# EAGLE schematic Main_Board (EAGLE 7.7.0)

## Sheet 1 of 5: Ethernet&CAN
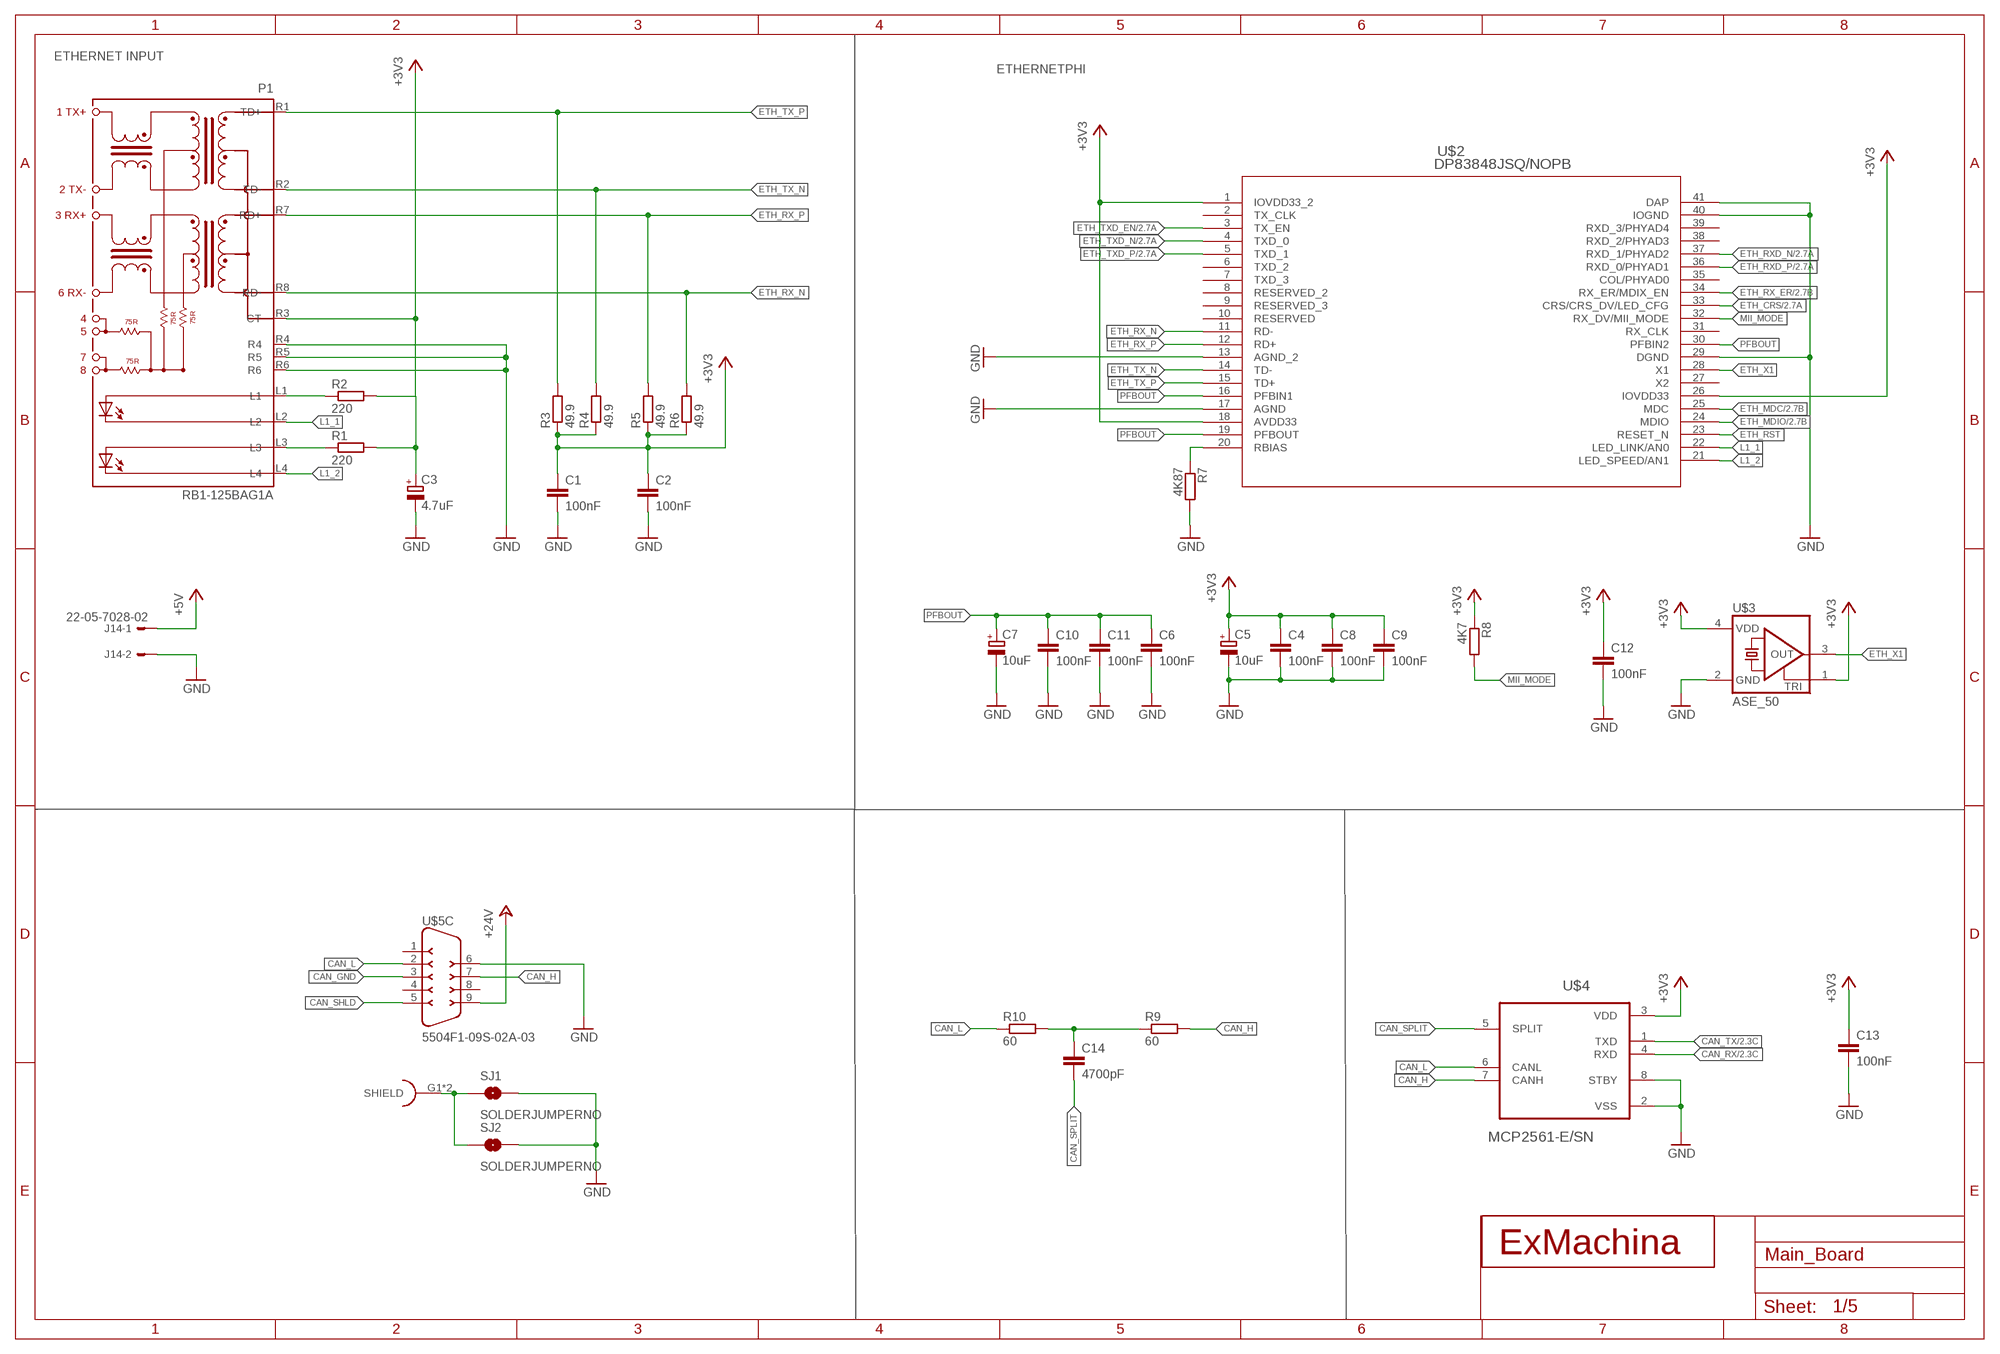
[diagram p0: schematic, sheet 1]

### Parts
C1  100nF  C-EUC0603  [C0603]
C2  100nF  C-EUC0603  [C0603]
C3  4.7uF  CPOL-EUCT3216  [CT3216]
C4  100nF  C-EUC0603  [C0603]
C5  10uF  CPOL-EUCT3216  [CT3216]
C6  100nF  C-EUC0603  [C0603]
C7  10uF  CPOL-EUCT3216  [CT3216]
C8  100nF  C-EUC0603  [C0603]
C9  100nF  C-EUC0603  [C0603]
C10  100nF  C-EUC0603  [C0603]
C11  100nF  C-EUC0603  [C0603]
C12  100nF  C-EUC0603  [C0603]
C13  100nF  C-EUC0603  [C0603]
C14  4700pF  C-EUC0603  [C0603]
J14  22-05-7028-02  [7395-02]
P1  RB1-125BAG1A  [WIZNET_RB1-125BAG1A]
R1  220  R-EU_R0603  [R0603]
R2  220  R-EU_R0603  [R0603]
R3  49.9  R-EU_R0603  [R0603]
R4  49.9  R-EU_R0603  [R0603]
R5  49.9  R-EU_R0603  [R0603]
R6  49.9  R-EU_R0603  [R0603]
R7  4K87  R-EU_R0603  [R0603]
R8  4K7  R-EU_R0603  [R0603]
R9  60  R-EU_R0603  [R0603]
R10  60  R-EU_R0603  [R0603]
SJ1  SOLDERJUMPERNO  [SJ_2S-NO]
SJ2  SOLDERJUMPERNO  [SJ_2S-NO]
U$1  EXMACHINA-LOGO-NAME  [EXM-LOGO-BASELINE]
U$2  DP83848JSQ/NOPB  [SQA40B]
U$3  ASE_50  ASE  [ASE]
U$4  MCP2561-E/SN  [SOIC127P600X175-8N]
U$5  5504F1-09S-02A-03  [5504F1-09S-02A]

### Nets
+3V3 [supply]: C1.1 C2.1 C3.+ C4.1 C5.+ C8.1 C9.1 C12.1 C13.1 P1.R3(CT) R1.2 R2.2 R3.1 R4.1 R5.1 R6.1 R8.1 U$2.1(IOVDD33_2) U$2.18(AVDD33) U$2.26(IOVDD33) U$3.1(TRI) U$3.4(VDD) U$4.3(VDD) ; also sheet 2,3,4,5
+5V [supply]: J14.1 ; also sheet 3,4,5
+24V: U$5.9 ; also sheet 3,5
CAN_GND: U$5.3
CAN_H [signal]: R9.2 U$4.7(CANH) U$5.7
CAN_L [signal]: R10.1 U$4.6(CANL) U$5.2
CAN_RX [signal]: U$4.4(RXD) ; also sheet 2
CAN_SHLD: U$5.5
CAN_SPLIT [signal]: C14.2 U$4.5(SPLIT)
CAN_TX [signal]: U$4.1(TXD) ; also sheet 2
ETH_CRS [signal]: U$2.33(CRS/CRS_DV/LED_CFG) ; also sheet 2
ETH_MDC [signal]: U$2.25(MDC) ; also sheet 2
ETH_MDIO [signal]: U$2.24(MDIO) ; also sheet 2
ETH_RST [signal]: U$2.23(RESET_N)
ETH_RX_ER [signal]: U$2.34(RX_ER/MDIX_EN) ; also sheet 2
ETH_RX_N [signal]: P1.R8(RD-) R6.2 U$2.11(RD-)
ETH_RX_P [signal]: P1.R7(RD+) R5.2 U$2.12(RD+)
ETH_RXD_N [signal]: U$2.37(RXD_1/PHYAD2) ; also sheet 2
ETH_RXD_P [signal]: U$2.36(RXD_0/PHYAD1) ; also sheet 2
ETH_TX_N [signal]: P1.R2(TD-) R4.2 U$2.14(TD-)
ETH_TX_P [signal]: P1.R1(TD+) R3.2 U$2.15(TD+)
ETH_TXD_EN [signal]: U$2.3(TX_EN) ; also sheet 2
ETH_TXD_N [signal]: U$2.4(TXD_0) ; also sheet 2
ETH_TXD_P [signal]: U$2.5(TXD_1) ; also sheet 2
ETH_X1 [signal]: U$2.28(X1) U$3.3(OUT)
GND [supply]: C1.2 C2.2 C3.- C4.2 C5.- C6.2 C7.- C8.2 C9.2 C10.2 C11.2 C12.2 C13.2 J14.2 P1.R4 P1.R5 P1.R6 R7.2 SJ1.2 SJ2.2 U$2.13(AGND_2) U$2.17(AGND) U$2.29(DGND) U$2.40(IOGND) U$2.41(DAP) U$3.2(GND) U$4.2(VSS) U$4.8(STBY) U$5.6 ; also sheet 2,3,4,5
L1_1 [signal]: P1.L2 U$2.22(LED_LINK/AN0)
L1_2 [signal]: P1.L4 U$2.21(LED_SPEED/AN1)
MII_MODE [signal]: R8.2 U$2.32(RX_DV/MII_MODE)
N$3: C14.1 R9.1 R10.2
N$4: R7.1 U$2.20(RBIAS)
N$6: SJ1.1 SJ2.1 U$5.G1(S:SHIELD) U$5.G2(S:SHIELD)
N$8 [signal]: P1.L1 R2.1
N$9 [signal]: P1.L3 R1.1
PFBOUT [signal]: C6.1 C7.+ C10.1 C11.1 U$2.16(PFBIN1) U$2.19(PFBOUT) U$2.30(PFBIN2)
Unconnected: U$2.2(TX_CLK) U$2.6(TXD_2) U$2.7(TXD_3) U$2.8(RESERVED_2) U$2.9(RESERVED_3) U$2.10(RESERVED) U$2.27(X2) U$2.31(RX_CLK) U$2.35(COL/PHYAD0) U$2.38(RXD_2/PHYAD3) U$2.39(RXD_3/PHYAD4) U$5.1 U$5.4 U$5.8

### Notes on the sheet
- ETHERNET INPUT
- ETHERNETPHI

## Sheet 2 of 5: LPC1768 + EEPROM
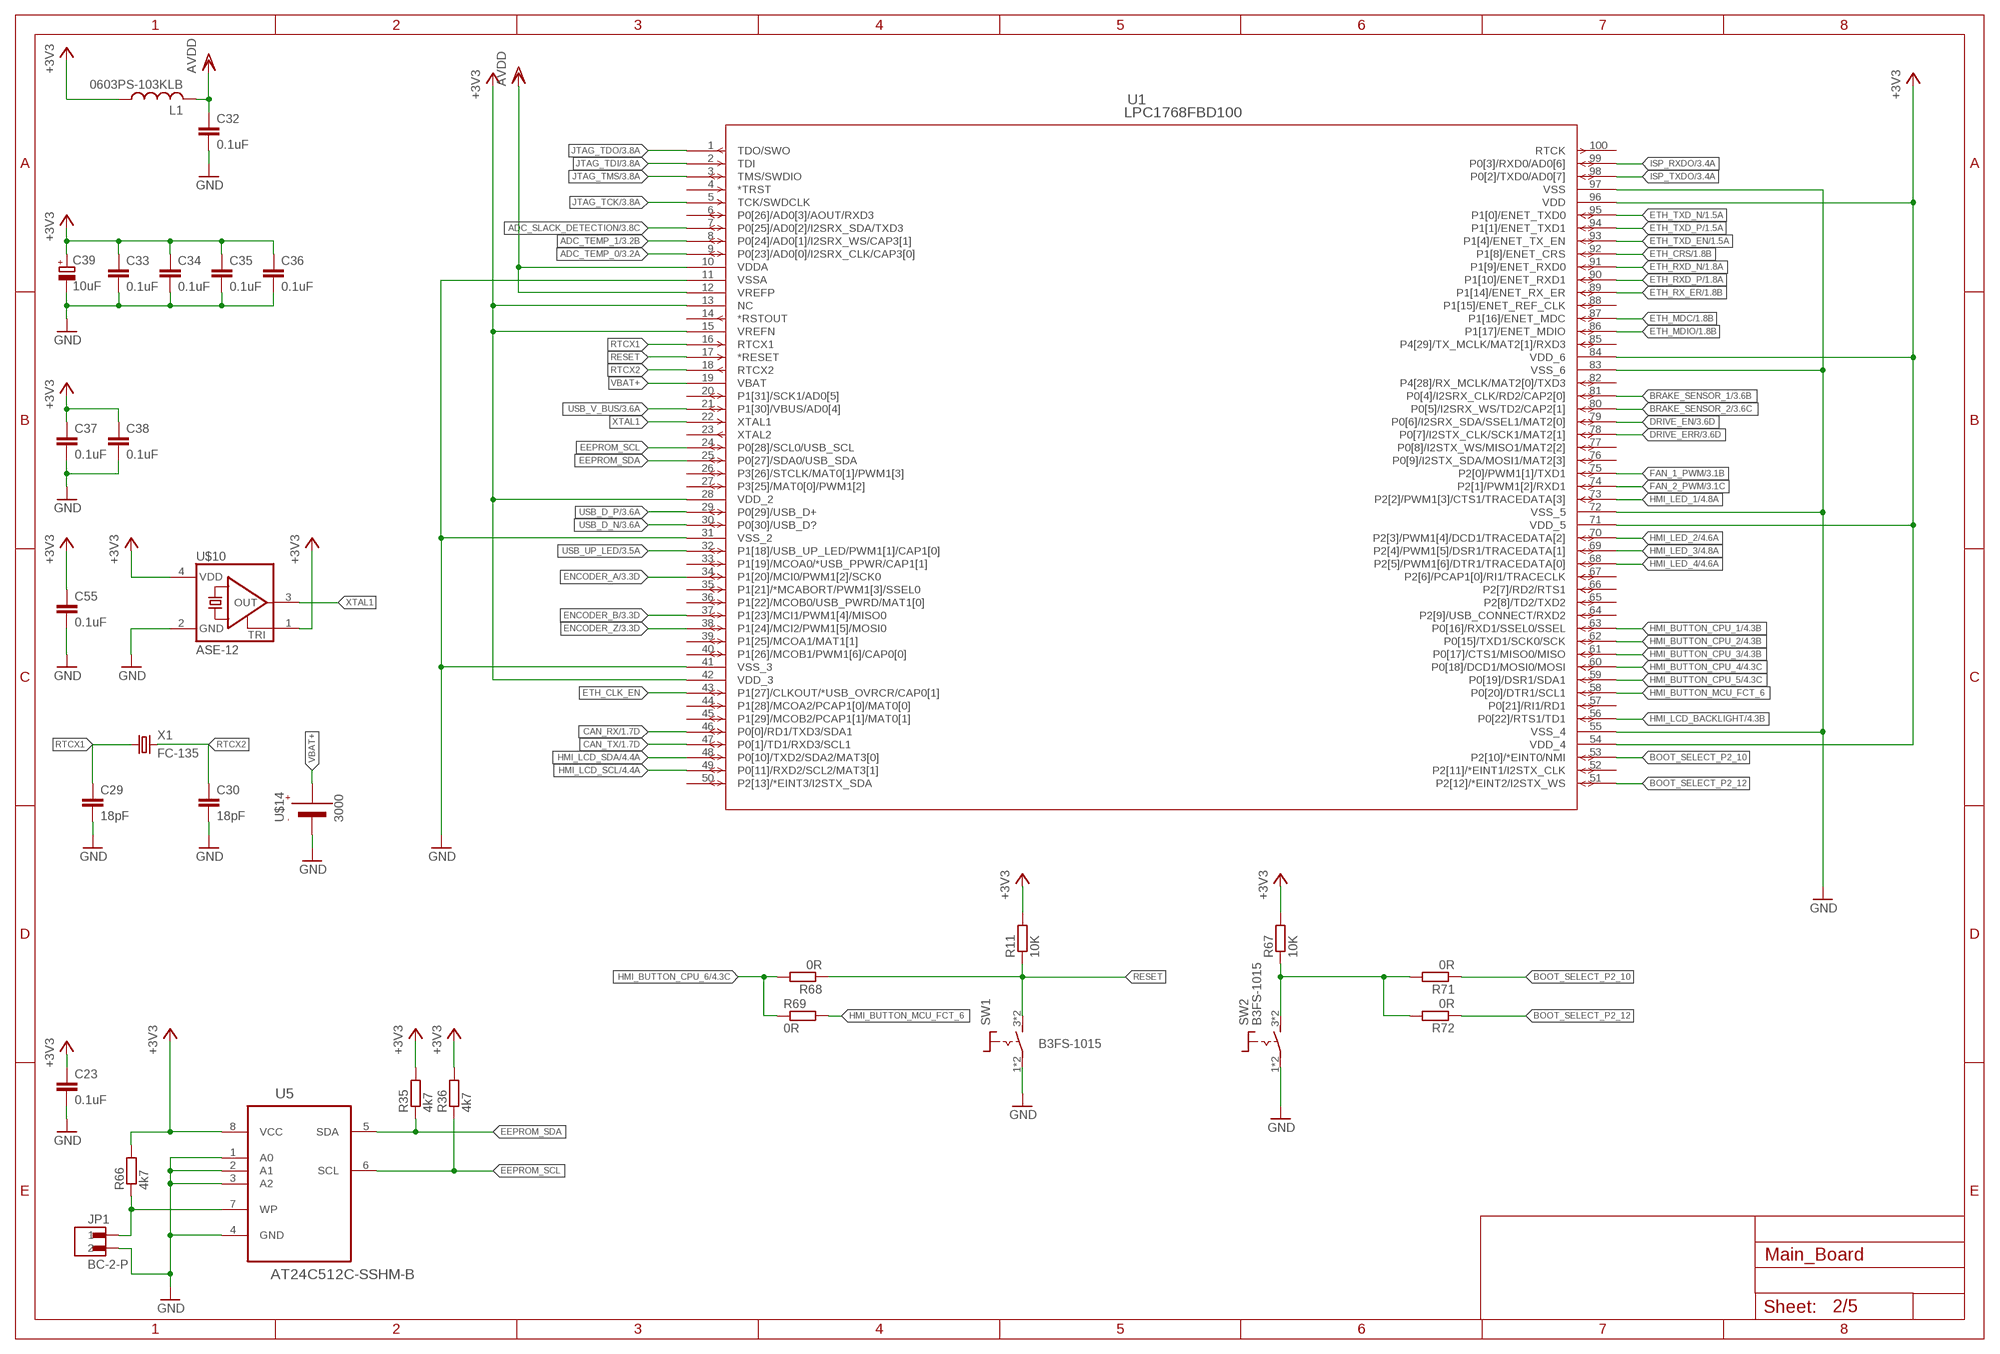
[diagram p1: schematic, sheet 2]

### Parts
C23  0.1uF  C-EUC0603  [C0603]
C29  18pF  C-EUC0603  [C0603]
C30  18pF  C-EUC0603  [C0603]
C32  0.1uF  C-EUC0603  [C0603]
C33  0.1uF  C-EUC0603  [C0603]
C34  0.1uF  C-EUC0603  [C0603]
C35  0.1uF  C-EUC0603  [C0603]
C36  0.1uF  C-EUC0603  [C0603]
C37  0.1uF  C-EUC0603  [C0603]
C38  0.1uF  C-EUC0603  [C0603]
C39  10uF  CPOL-EUCT3216  [CT3216]
C55  0.1uF  C-EUC0603  [C0603]
JP1  BC-2-P  [BC-2-P]
L1  0603PS-103KLB  0603PS  [0603]
R11  10K  R-EU_R0603  [R0603]
R35  4k7  R-EU_R0603  [R0603]
R36  4k7  R-EU_R0603  [R0603]
R66  4k7  R-EU_R0603  [R0603]
R67  10K  R-EU_R0603  [R0603]
R68  0R  R-EU_R0603  [R0603]
R69  0R  R-EU_R0603  [R0603]
R71  0R  R-EU_R0603  [R0603]
R72  0R  R-EU_R0603  [R0603]
SW1  B3FS-1015  [B3FS]
SW2  B3FS-1015  [B3FS]
U1  LPC1768FBD100  [SOT407-1]
U5  AT24C512C-SSHM-B  [SOIC127P600X175-8N]
U$10  ASE-12  ASE  [ASE]
U$14  3000  [3000]
X1  FC-135  [FC-135]

### Nets
+3V3 [supply]: C23.1 C33.1 C34.1 C35.1 C36.1 C37.1 C38.1 C39.+ C55.1 L1.P$1 R11.2 R35.2 R36.2 R66.2 R67.2 U1.13(NC) U1.15(VREFN) U1.28(VDD_2) U1.42(VDD_3) U1.54(VDD_4) U1.71(VDD_5) U1.84(VDD_6) U1.96(VDD) U5.8(VCC) U$10.1(TRI) U$10.4(VDD) ; also sheet 1,3,4,5
ADC_SLACK_DETECTION [signal]: U1.7(P0[25]/AD0[2]/I2SRX_SDA/TXD3) ; also sheet 3
ADC_TEMP_0 [signal]: U1.9(P0[23]/AD0[0]/I2SRX_CLK/CAP3[0]) ; also sheet 3
ADC_TEMP_1 [signal]: U1.8(P0[24]/AD0[1]/I2SRX_WS/CAP3[1]) ; also sheet 3
AVDD: C32.1 L1.P$2 U1.10(VDDA) U1.12(VREFP) ; also sheet 3
BOOT_SELECT_P2_10 [signal]: R71.1 U1.53(P2[10]/*EINT0/NMI)
BOOT_SELECT_P2_12 [signal]: R72.1 U1.51(P2[12]/*EINT2/I2STX_WS)
BRAKE_SENSOR_1: U1.81(P0[4]/I2SRX_CLK/RD2/CAP2[0]) ; also sheet 3
BRAKE_SENSOR_2: U1.80(P0[5]/I2SRX_WS/TD2/CAP2[1]) ; also sheet 3
CAN_RX [signal]: U1.46(P0[0]/RD1/TXD3/SDA1) ; also sheet 1
CAN_TX [signal]: U1.47(P0[1]/TD1/RXD3/SCL1) ; also sheet 1
DRIVE_EN: U1.79(P0[6]/I2SRX_SDA/SSEL1/MAT2[0]) ; also sheet 3
DRIVE_ERR: U1.78(P0[7]/I2STX_CLK/SCK1/MAT2[1]) ; also sheet 3
EEPROM_SCL: R36.1 U1.24(P0[28]/SCL0/USB_SCL) U5.6(SCL)
EEPROM_SDA: R35.1 U1.25(P0[27]/SDA0/USB_SDA) U5.5(SDA)
ENCODER_A: U1.34(P1[20]/MCI0/PWM1[2]/SCK0) ; also sheet 3
ENCODER_B: U1.37(P1[23]/MCI1/PWM1[4]/MISO0) ; also sheet 3
ENCODER_Z: U1.38(P1[24]/MCI2/PWM1[5]/MOSI0) ; also sheet 3
ETH_CLK_EN [signal]: U1.43(P1[27]/CLKOUT/*USB_OVRCR/CAP0[1])
ETH_CRS [signal]: U1.92(P1[8]/ENET_CRS) ; also sheet 1
ETH_MDC [signal]: U1.87(P1[16]/ENET_MDC) ; also sheet 1
ETH_MDIO [signal]: U1.86(P1[17]/ENET_MDIO) ; also sheet 1
ETH_RX_ER [signal]: U1.89(P1[14]/ENET_RX_ER) ; also sheet 1
ETH_RXD_N [signal]: U1.91(P1[9]/ENET_RXD0) ; also sheet 1
ETH_RXD_P [signal]: U1.90(P1[10]/ENET_RXD1) ; also sheet 1
ETH_TXD_EN [signal]: U1.93(P1[4]/ENET_TX_EN) ; also sheet 1
ETH_TXD_N [signal]: U1.95(P1[0]/ENET_TXD0) ; also sheet 1
ETH_TXD_P [signal]: U1.94(P1[1]/ENET_TXD1) ; also sheet 1
FAN_1_PWM [signal]: U1.75(P2[0]/PWM1[1]/TXD1) ; also sheet 3
FAN_2_PWM [signal]: U1.74(P2[1]/PWM1[2]/RXD1) ; also sheet 3
GND [supply]: C23.2 C29.2 C30.2 C32.2 C33.2 C34.2 C35.2 C36.2 C37.2 C38.2 C39.- C55.2 JP1.2 SW1.1 SW1.2 SW2.1 SW2.2 U1.11(VSSA) U1.31(VSS_2) U1.41(VSS_3) U1.55(VSS_4) U1.72(VSS_5) U1.83(VSS_6) U1.97(VSS) U5.1(A0) U5.2(A1) U5.3(A2) U5.4(GND) U$10.2(GND) U$14.-(VBAT-) ; also sheet 1,3,4,5
HMI_BUTTON_CPU_1: U1.63(P0[16]/RXD1/SSEL0/SSEL) ; also sheet 4
HMI_BUTTON_CPU_2: U1.62(P0[15]/TXD1/SCK0/SCK) ; also sheet 4
HMI_BUTTON_CPU_3: U1.61(P0[17]/CTS1/MISO0/MISO) ; also sheet 4
HMI_BUTTON_CPU_4: U1.60(P0[18]/DCD1/MOSI0/MOSI) ; also sheet 4
HMI_BUTTON_CPU_5: U1.59(P0[19]/DSR1/SDA1) ; also sheet 4
HMI_BUTTON_CPU_6: R68.2 R69.1 ; also sheet 4
HMI_BUTTON_MCU_FCT_6: R69.2 U1.58(P0[20]/DTR1/SCL1)
HMI_LCD_BACKLIGHT: U1.56(P0[22]/RTS1/TD1) ; also sheet 4
HMI_LCD_SCL [signal]: U1.49(P0[11]/RXD2/SCL2/MAT3[1]) ; also sheet 4
HMI_LCD_SDA [signal]: U1.48(P0[10]/TXD2/SDA2/MAT3[0]) ; also sheet 4
HMI_LED_1 [signal]: U1.73(P2[2]/PWM1[3]/CTS1/TRACEDATA[3]) ; also sheet 4
HMI_LED_2 [signal]: U1.70(P2[3]/PWM1[4]/DCD1/TRACEDATA[2]) ; also sheet 4
HMI_LED_3 [signal]: U1.69(P2[4]/PWM1[5]/DSR1/TRACEDATA[1]) ; also sheet 4
HMI_LED_4 [signal]: U1.68(P2[5]/PWM1[6]/DTR1/TRACEDATA[0]) ; also sheet 4
ISP_RXDO [signal]: U1.99(P0[3]/RXD0/AD0[6]) ; also sheet 3
ISP_TXDO [signal]: U1.98(P0[2]/TXD0/AD0[7]) ; also sheet 3
JTAG_TCK [signal]: U1.5(TCK/SWDCLK) ; also sheet 3
JTAG_TDI [signal]: U1.2(TDI) ; also sheet 3
JTAG_TDO [signal]: U1.1(TDO/SWO) ; also sheet 3
JTAG_TMS [signal]: U1.3(TMS/SWDIO) ; also sheet 3
N$5 [signal]: R67.1 R71.2 R72.2 SW2.3 SW2.4
N$22: JP1.1 R66.1 U5.7(WP)
RESET: R11.1 R68.1 SW1.3 SW1.4 U1.17(*RESET)
RTCX1: C29.1 U1.16(RTCX1) X1.1
RTCX2: C30.1 U1.18(RTCX2) X1.2
USB_D_N [signal]: U1.30(P0[30]/USB_D?) ; also sheet 3
USB_D_P [signal]: U1.29(P0[29]/USB_D+) ; also sheet 3
USB_UP_LED [signal]: U1.32(P1[18]/USB_UP_LED/PWM1[1]/CAP1[0]) ; also sheet 3
USB_V_BUS [signal]: U1.21(P1[30]/VBUS/AD0[4]) ; also sheet 3
VBAT+: U1.19(VBAT) U$14.+1(VBAT+) U$14.+2(VBAT+)
XTAL1: U1.22(XTAL1) U$10.3(OUT)
Unconnected: U1.4(*TRST) U1.6(P0[26]/AD0[3]/AOUT/RXD3) U1.14(*RSTOUT) U1.20(P1[31]/SCK1/AD0[5]) U1.23(XTAL2) U1.26(P3[26]/STCLK/MAT0[1]/PWM1[3]) U1.27(P3[25]/MAT0[0]/PWM1[2]) U1.33(P1[19]/MCOA0/*USB_PPWR/CAP1[1]) U1.35(P1[21]/*MCABORT/PWM1[3]/SSEL0) U1.36(P1[22]/MCOB0/USB_PWRD/MAT1[0]) U1.39(P1[25]/MCOA1/MAT1[1]) U1.40(P1[26]/MCOB1/PWM1[6]/CAP0[0]) U1.44(P1[28]/MCOA2/PCAP1[0]/MAT0[0]) U1.45(P1[29]/MCOB2/PCAP1[1]/MAT0[1]) U1.50(P2[13]/*EINT3/I2STX_SDA) U1.52(P2[11]/*EINT1/I2STX_CLK) U1.57(P0[21]/RI1/RD1) U1.64(P2[9]/USB_CONNECT/RXD2) U1.65(P2[8]/TD2/TXD2) U1.66(P2[7]/RD2/RTS1) U1.67(P2[6]/PCAP1[0]/RI1/TRACECLK) U1.76(P0[9]/I2STX_SDA/MOSI1/MAT2[3]) U1.77(P0[8]/I2STX_WS/MISO1/MAT2[2]) U1.82(P4[28]/RX_MCLK/MAT2[0]/TXD3) U1.85(P4[29]/TX_MCLK/MAT2[1]/RXD3) U1.88(P1[15]/ENET_REF_CLK) U1.100(RTCK)

## Sheet 3 of 5: Motor Sensors
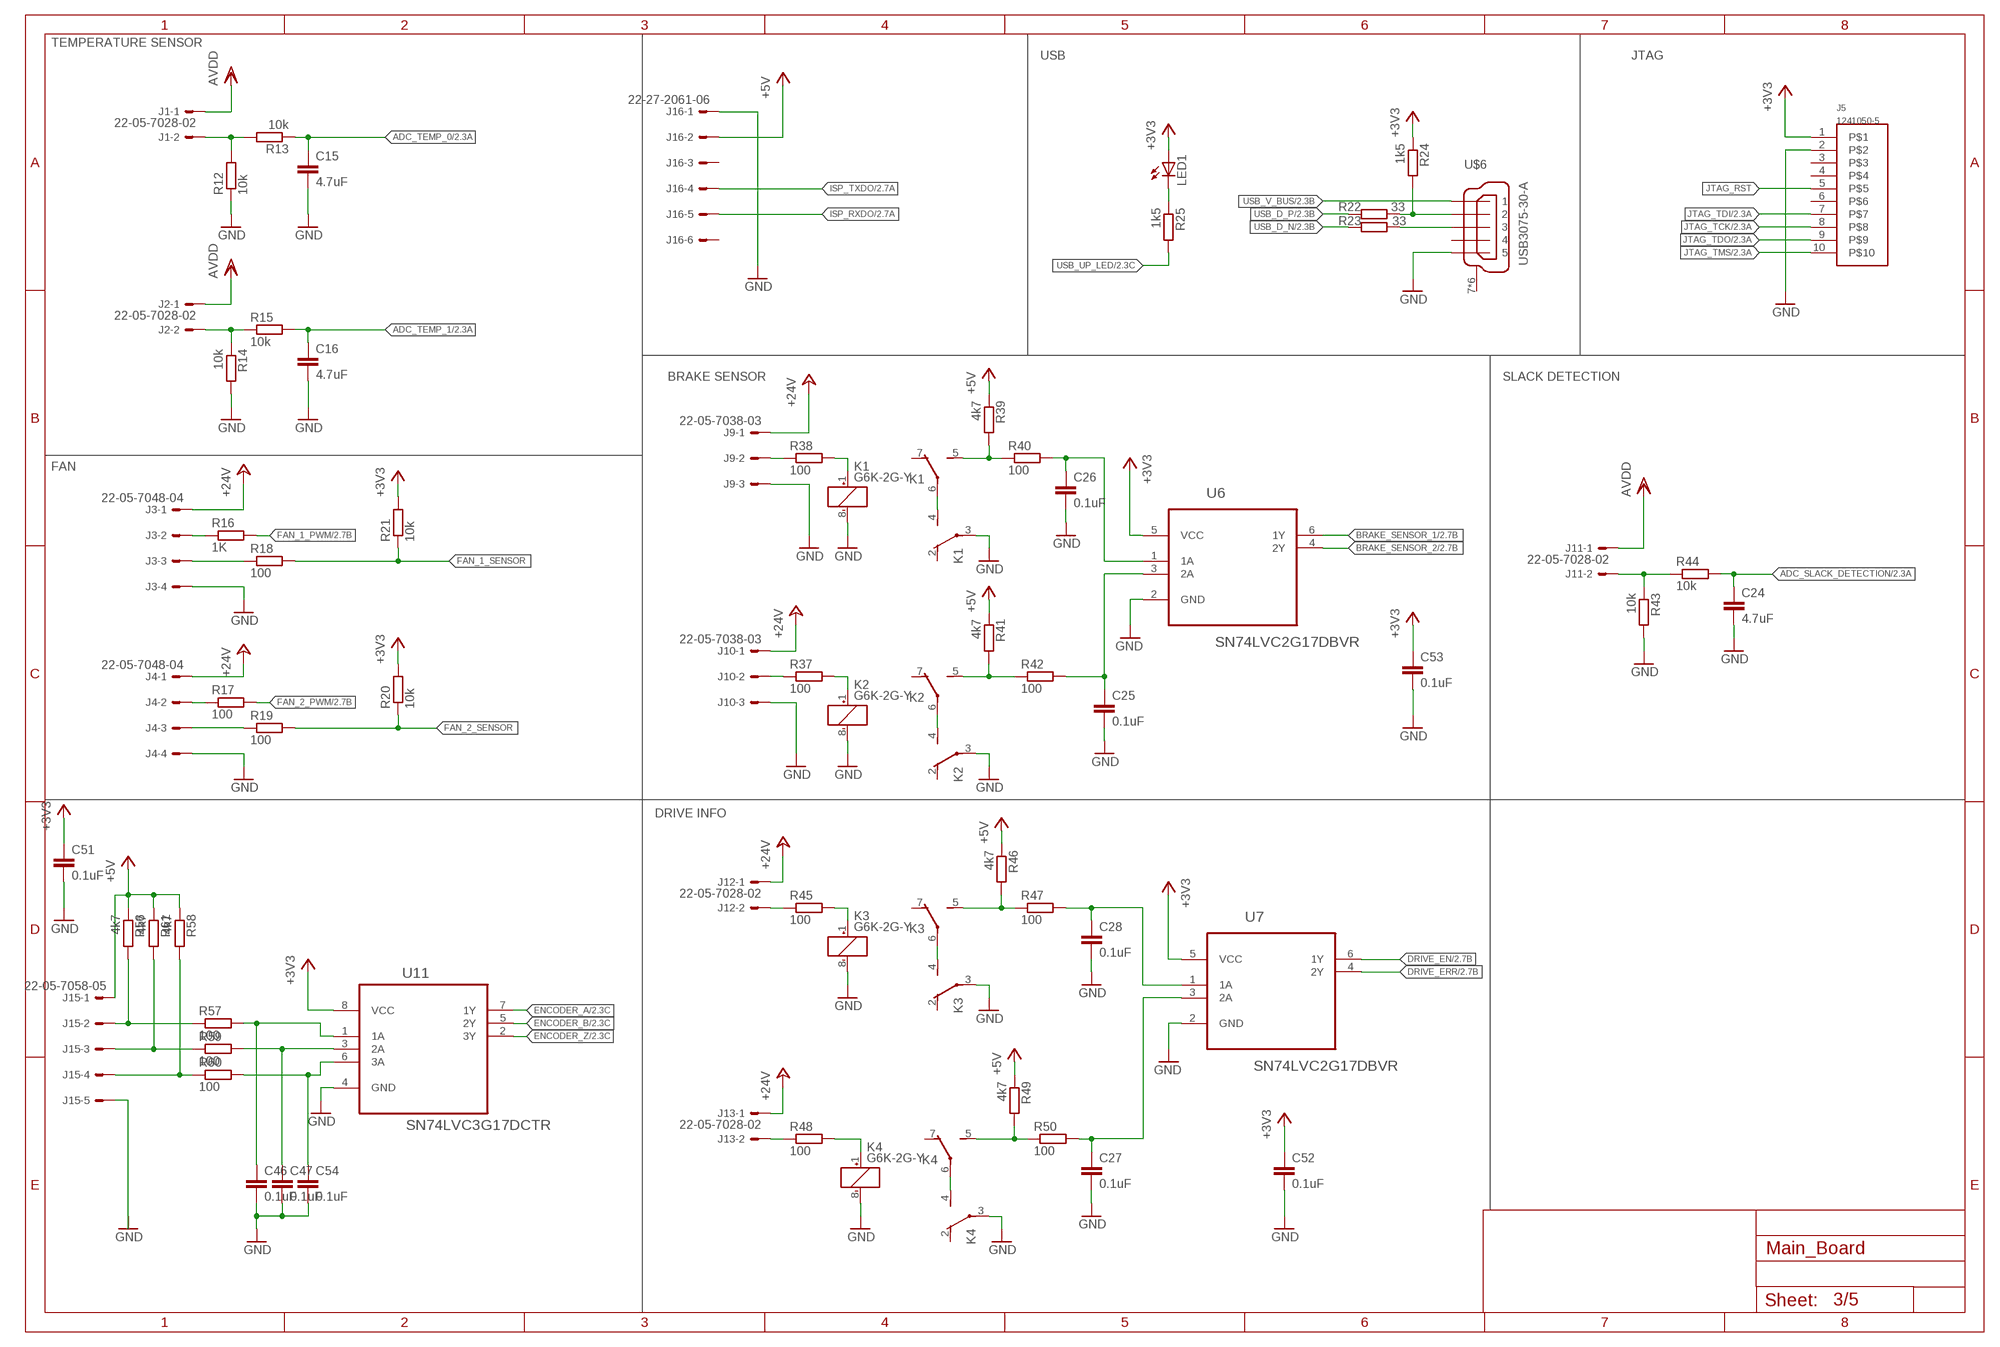
[diagram p2: schematic, sheet 3]

### Parts
C15  4.7uF  C-EUC0603  [C0603]
C16  4.7uF  C-EUC0603  [C0603]
C24  4.7uF  C-EUC0603  [C0603]
C25  0.1uF  C-EUC0603  [C0603]
C26  0.1uF  C-EUC0603  [C0603]
C27  0.1uF  C-EUC0603  [C0603]
C28  0.1uF  C-EUC0603  [C0603]
C46  0.1uF  C-EUC0603  [C0603]
C47  0.1uF  C-EUC0603  [C0603]
C51  0.1uF  C-EUC0603  [C0603]
C52  0.1uF  C-EUC0603  [C0603]
C53  0.1uF  C-EUC0603  [C0603]
C54  0.1uF  C-EUC0603  [C0603]
J1  22-05-7028-02  [7395-02]
J2  22-05-7028-02  [7395-02]
J3  22-05-7048-04  [7395-04]
J4  22-05-7048-04  [7395-04]
J5  1241050-5  [2.54/2X5]
J9  22-05-7038-03  [7395-03]
J10  22-05-7038-03  [7395-03]
J11  22-05-7028-02  [7395-02]
J12  22-05-7028-02  [7395-02]
J13  22-05-7028-02  [7395-02]
J15  22-05-7058-05  [7395-05]
J16  22-27-2061-06  [6410-06]
K1  G6K-2G-Y  [G6K-2G-Y]
K2  G6K-2G-Y  [G6K-2G-Y]
K3  G6K-2G-Y  [G6K-2G-Y]
K4  G6K-2G-Y  [G6K-2G-Y]
LED1  LEDCHIPLED_0603  [CHIPLED_0603]
R12  10k  R-EU_R0603  [R0603]
R13  10k  R-EU_R0603  [R0603]
R14  10k  R-EU_R0603  [R0603]
R15  10k  R-EU_R0603  [R0603]
R16  1K  R-EU_R0603  [R0603]
R17  100  R-EU_R0603  [R0603]
R18  100  R-EU_R0603  [R0603]
R19  100  R-EU_R0603  [R0603]
R20  10k  R-EU_R0603  [R0603]
R21  10k  R-EU_R0603  [R0603]
R22  33  R-EU_R0603  [R0603]
R23  33  R-EU_R0603  [R0603]
R24  1k5  R-EU_R0603  [R0603]
R25  1k5  R-EU_R0603  [R0603]
R37  100  R-EU_R0603  [R0603]
R38  100  R-EU_R0603  [R0603]
R39  4k7  R-EU_R0603  [R0603]
R40  100  R-EU_R0603  [R0603]
R41  4k7  R-EU_R0603  [R0603]
R42  100  R-EU_R0603  [R0603]
R43  10k  R-EU_R0603  [R0603]
R44  10k  R-EU_R0603  [R0603]
R45  100  R-EU_R0603  [R0603]
R46  4k7  R-EU_R0603  [R0603]
R47  100  R-EU_R0603  [R0603]
R48  100  R-EU_R0603  [R0603]
R49  4k7  R-EU_R0603  [R0603]
R50  100  R-EU_R0603  [R0603]
R56  4k7  R-EU_R0603  [R0603]
R57  100  R-EU_R0603  [R0603]
R58  4k7  R-EU_R0603  [R0603]
R59  100  R-EU_R0603  [R0603]
R60  100  R-EU_R0603  [R0603]
R61  4k7  R-EU_R0603  [R0603]
U6  SN74LVC2G17DBVR  [SOT95P280X145-6N]
U7  SN74LVC2G17DBVR  [SOT95P280X145-6N]
U11  SN74LVC3G17DCTR  [SOP65P400X130-8N]
U$6  USB3075-30-A  [USB_MICROB_SMT]

### Nets
+3V3 [supply]: C51.1 C52.1 C53.1 J5.1 LED1.A R20.2 R21.2 R24.1 U6.5(VCC) U7.5(VCC) U11.8(VCC) ; also sheet 1,2,4,5
+5V [supply]: J15.1 J16.2 R39.1 R41.1 R46.1 R49.1 R56.1 R58.1 R61.1 ; also sheet 1,4,5
+24V: J3.1 J4.1 J9.1 J10.1 J12.1 J13.1 ; also sheet 1,5
ADC_SLACK_DETECTION [signal]: C24.1 R44.2 ; also sheet 2
ADC_TEMP_0 [signal]: C15.1 R13.1 ; also sheet 2
ADC_TEMP_1 [signal]: C16.1 R15.2 ; also sheet 2
AVDD: J1.1 J2.1 J11.1 ; also sheet 2
BRAKE_SENSOR_1: U6.6(1Y) ; also sheet 2
BRAKE_SENSOR_2: U6.4(2Y) ; also sheet 2
DRIVE_EN: U7.6(1Y) ; also sheet 2
DRIVE_ERR: U7.4(2Y) ; also sheet 2
ENCODER_A: U11.7(1Y) ; also sheet 2
ENCODER_B: U11.5(2Y) ; also sheet 2
ENCODER_Z: U11.2(3Y) ; also sheet 2
FAN_1_PWM [signal]: R16.2 ; also sheet 2
FAN_1_SENSOR [signal]: R18.2 R21.1
FAN_2_PWM [signal]: R17.2 ; also sheet 2
FAN_2_SENSOR [signal]: R19.2 R20.1
GND [supply]: C15.2 C16.2 C24.2 C25.2 C26.2 C27.2 C28.2 C46.2 C47.2 C51.2 C52.2 C53.2 C54.2 J3.4 J4.4 J5.2 J9.3 J10.3 J16.1 K1.3(2:P) K1.8(1:-) K2.3(2:P) K2.8(1:-) K3.3(2:P) K3.8(1:-) K4.3(2:P) K4.8(1:-) R12.1 R14.2 R43.2 U6.2(GND) U7.2(GND) U11.4(GND) U$6.5 ; also sheet 1,2,4,5
ISP_RXDO [signal]: J16.5 ; also sheet 2
ISP_TXDO [signal]: J16.4 ; also sheet 2
JTAG_RST [signal]: J5.5
JTAG_TCK [signal]: J5.8 ; also sheet 2
JTAG_TDI [signal]: J5.7 ; also sheet 2
JTAG_TDO [signal]: J5.9 ; also sheet 2
JTAG_TMS [signal]: J5.10 ; also sheet 2
N$11 [signal]: J3.2 R16.1
N$12 [signal]: J4.3 R19.1
N$13 [signal]: J4.2 R17.1
N$14 [signal]: J3.3 R18.1
N$15 [signal]: R22.1 R24.2 U$6.2
N$16 [signal]: R23.1 U$6.3
N$18 [signal]: LED1.C R25.1
N$21: J9.2 R38.1
N$23: J10.2 R37.1
N$24: K1.1(1:+) R38.2
N$28: K3.1(1:+) R45.2
N$29: K1.4(2:S) K1.6(3:P)
N$30: K2.5(3:S) R41.2 R42.1
N$32: J12.2 R45.1
N$33: K4.1(1:+) R48.2
N$34: K3.5(3:S) R46.2 R47.1
N$35: J15.2 R56.2 R57.1
N$36: K4.5(3:S) R49.2 R50.1
N$37: J13.2 R48.1
N$38: C25.1 R42.2 U6.3(2A)
N$39: C26.1 R40.2 U6.1(1A)
N$40: J15.3 R59.1 R61.2
N$41: C28.1 R47.2 U7.1(1A)
N$42: C27.1 R50.2 U7.3(2A)
N$46: J15.4 R58.2 R60.1
N$52: C54.1 R60.2 U11.6(3A)
N$53: C47.1 R59.2 U11.3(2A)
N$54: C46.1 R57.2 U11.1(1A)
N$55: K2.1(1:+) R37.2
N$57: K2.4(2:S) K2.6(3:P)
N$58: K1.5(3:S) R39.2 R40.1
N$59: K4.4(2:S) K4.6(3:P)
N$60: K3.4(2:S) K3.6(3:P)
N$62: J15.5
N$65: J1.2 R12.2 R13.2
N$66: J2.2 R14.1 R15.1
N$67: J11.2 R43.1 R44.1
USB_D_N [signal]: R23.2 ; also sheet 2
USB_D_P [signal]: R22.2 ; also sheet 2
USB_UP_LED [signal]: R25.2 ; also sheet 2
USB_V_BUS [signal]: U$6.1 ; also sheet 2
Unconnected: J5.3 J5.4 J5.6 J16.3 J16.6 K1.2(2:O) K1.7(3:O) K2.2(2:O) K2.7(3:O) K3.2(2:O) K3.7(3:O) K4.2(2:O) K4.7(3:O) U$6.4 U$6.7(S) U$6.8(S) U$6.9(S) U$6.10(S) U$6.11(S) U$6.12(S)

### Notes on the sheet
- TEMPERATURE SENSOR
- USB | JTAG
- BRAKE SENSOR | SLACK DETECTION
- FAN
- DRIVE INFO

## Sheet 4 of 5: HMI Interface
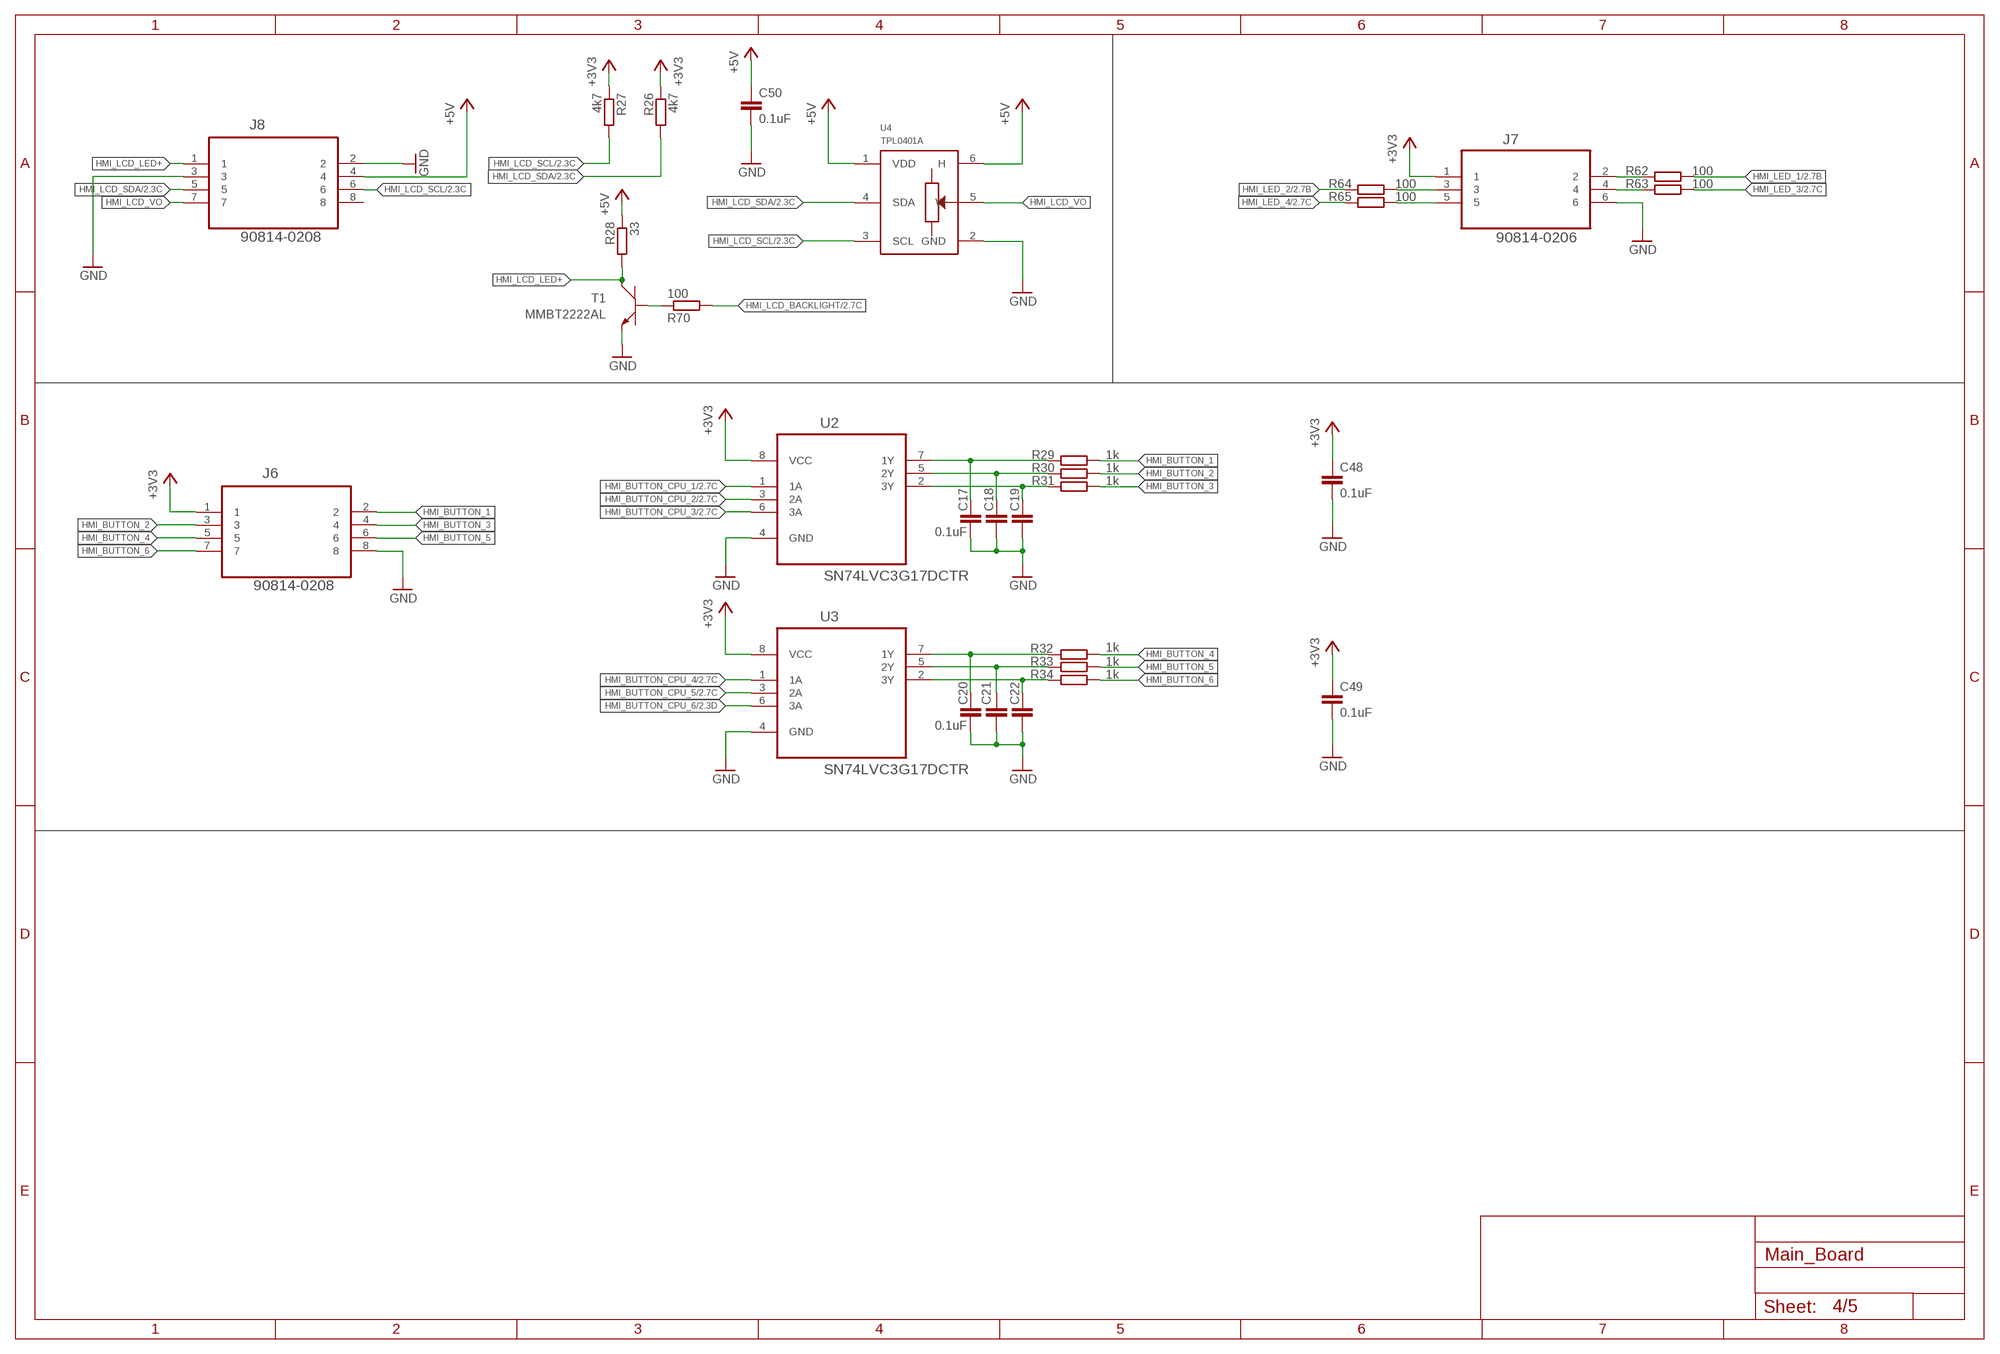
[diagram p3: schematic, sheet 4]

### Parts
C17  0.1uF  C-EUC0603  [C0603]
C18  0.1uF  C-EUC0603  [C0603]
C19  0.1uF  C-EUC0603  [C0603]
C20  0.1uF  C-EUC0603  [C0603]
C21  0.1uF  C-EUC0603  [C0603]
C22  0.1uF  C-EUC0603  [C0603]
C48  0.1uF  C-EUC0603  [C0603]
C49  0.1uF  C-EUC0603  [C0603]
C50  0.1uF  C-EUC0603  [C0603]
J6  90814-0208  [MOLEX_90814-0208]
J7  90814-0206  [MOLEX_90814-0206]
J8  90814-0208  [MOLEX_90814-0208]
R26  4k7  R-EU_R0603  [R0603]
R27  4k7  R-EU_R0603  [R0603]
R28  33  R-EU_R0603  [R0603]
R29  1k  R-EU_R0603  [R0603]
R30  1k  R-EU_R0603  [R0603]
R31  1k  R-EU_R0603  [R0603]
R32  1k  R-EU_R0603  [R0603]
R33  1k  R-EU_R0603  [R0603]
R34  1k  R-EU_R0603  [R0603]
R62  100  R-EU_R0603  [R0603]
R63  100  R-EU_R0603  [R0603]
R64  100  R-EU_R0603  [R0603]
R65  100  R-EU_R0603  [R0603]
R70  100  R-EU_R0603  [R0603]
T1  MMBT2222AL  [SOT−23]
U2  SN74LVC3G17DCTR  [SOP65P400X130-8N]
U3  SN74LVC3G17DCTR  [SOP65P400X130-8N]
U4  TPL0401A  [SC-70-DCK]

### Nets
+3V3 [supply]: C48.1 C49.1 J6.1 J7.1 R26.1 R27.1 U2.8(VCC) U3.8(VCC) ; also sheet 1,2,3,5
+5V [supply]: C50.1 J8.4 R28.1 U4.1(VDD) U4.6(H) ; also sheet 1,3,5
GND [supply]: C17.2 C18.2 C19.2 C20.2 C21.2 C22.2 C48.2 C49.2 C50.2 J6.8 J7.6 J8.2 J8.3 T1.2(E) U2.4(GND) U3.4(GND) U4.2(GND) ; also sheet 1,2,3,5
HMI_BUTTON_1 [signal]: J6.2 R29.1
HMI_BUTTON_2 [signal]: J6.3 R30.1
HMI_BUTTON_3 [signal]: J6.4 R31.1
HMI_BUTTON_4 [signal]: J6.5 R32.1
HMI_BUTTON_5 [signal]: J6.6 R33.1
HMI_BUTTON_6: J6.7 R34.1
HMI_BUTTON_CPU_1: U2.1(1A) ; also sheet 2
HMI_BUTTON_CPU_2: U2.3(2A) ; also sheet 2
HMI_BUTTON_CPU_3: U2.6(3A) ; also sheet 2
HMI_BUTTON_CPU_4: U3.1(1A) ; also sheet 2
HMI_BUTTON_CPU_5: U3.3(2A) ; also sheet 2
HMI_BUTTON_CPU_6: U3.6(3A) ; also sheet 2
HMI_LCD_BACKLIGHT: R70.2 ; also sheet 2
HMI_LCD_LED+: J8.1 R28.2 T1.3(C)
HMI_LCD_SCL [signal]: J8.6 R27.2 U4.3(SCL) ; also sheet 2
HMI_LCD_SDA [signal]: J8.5 R26.2 U4.4(SDA) ; also sheet 2
HMI_LCD_VO: J8.7 U4.5(W)
HMI_LED_1 [signal]: R62.1 ; also sheet 2
HMI_LED_2 [signal]: R64.2 ; also sheet 2
HMI_LED_3 [signal]: R63.1 ; also sheet 2
HMI_LED_4 [signal]: R65.2 ; also sheet 2
N$1: J7.3 R64.1
N$2: J7.5 R65.1
N$7: R70.1 T1.1(B)
N$17: C17.1 R29.2 U2.7(1Y)
N$19: C18.1 R30.2 U2.5(2Y)
N$20: C19.1 R31.2 U2.2(3Y)
N$25: C20.1 R32.2 U3.7(1Y)
N$26: C21.1 R33.2 U3.5(2Y)
N$27: C22.1 R34.2 U3.2(3Y)
N$63: J7.2 R62.2
N$64: J7.4 R63.2
Unconnected: J8.8

## Sheet 5 of 5: Power
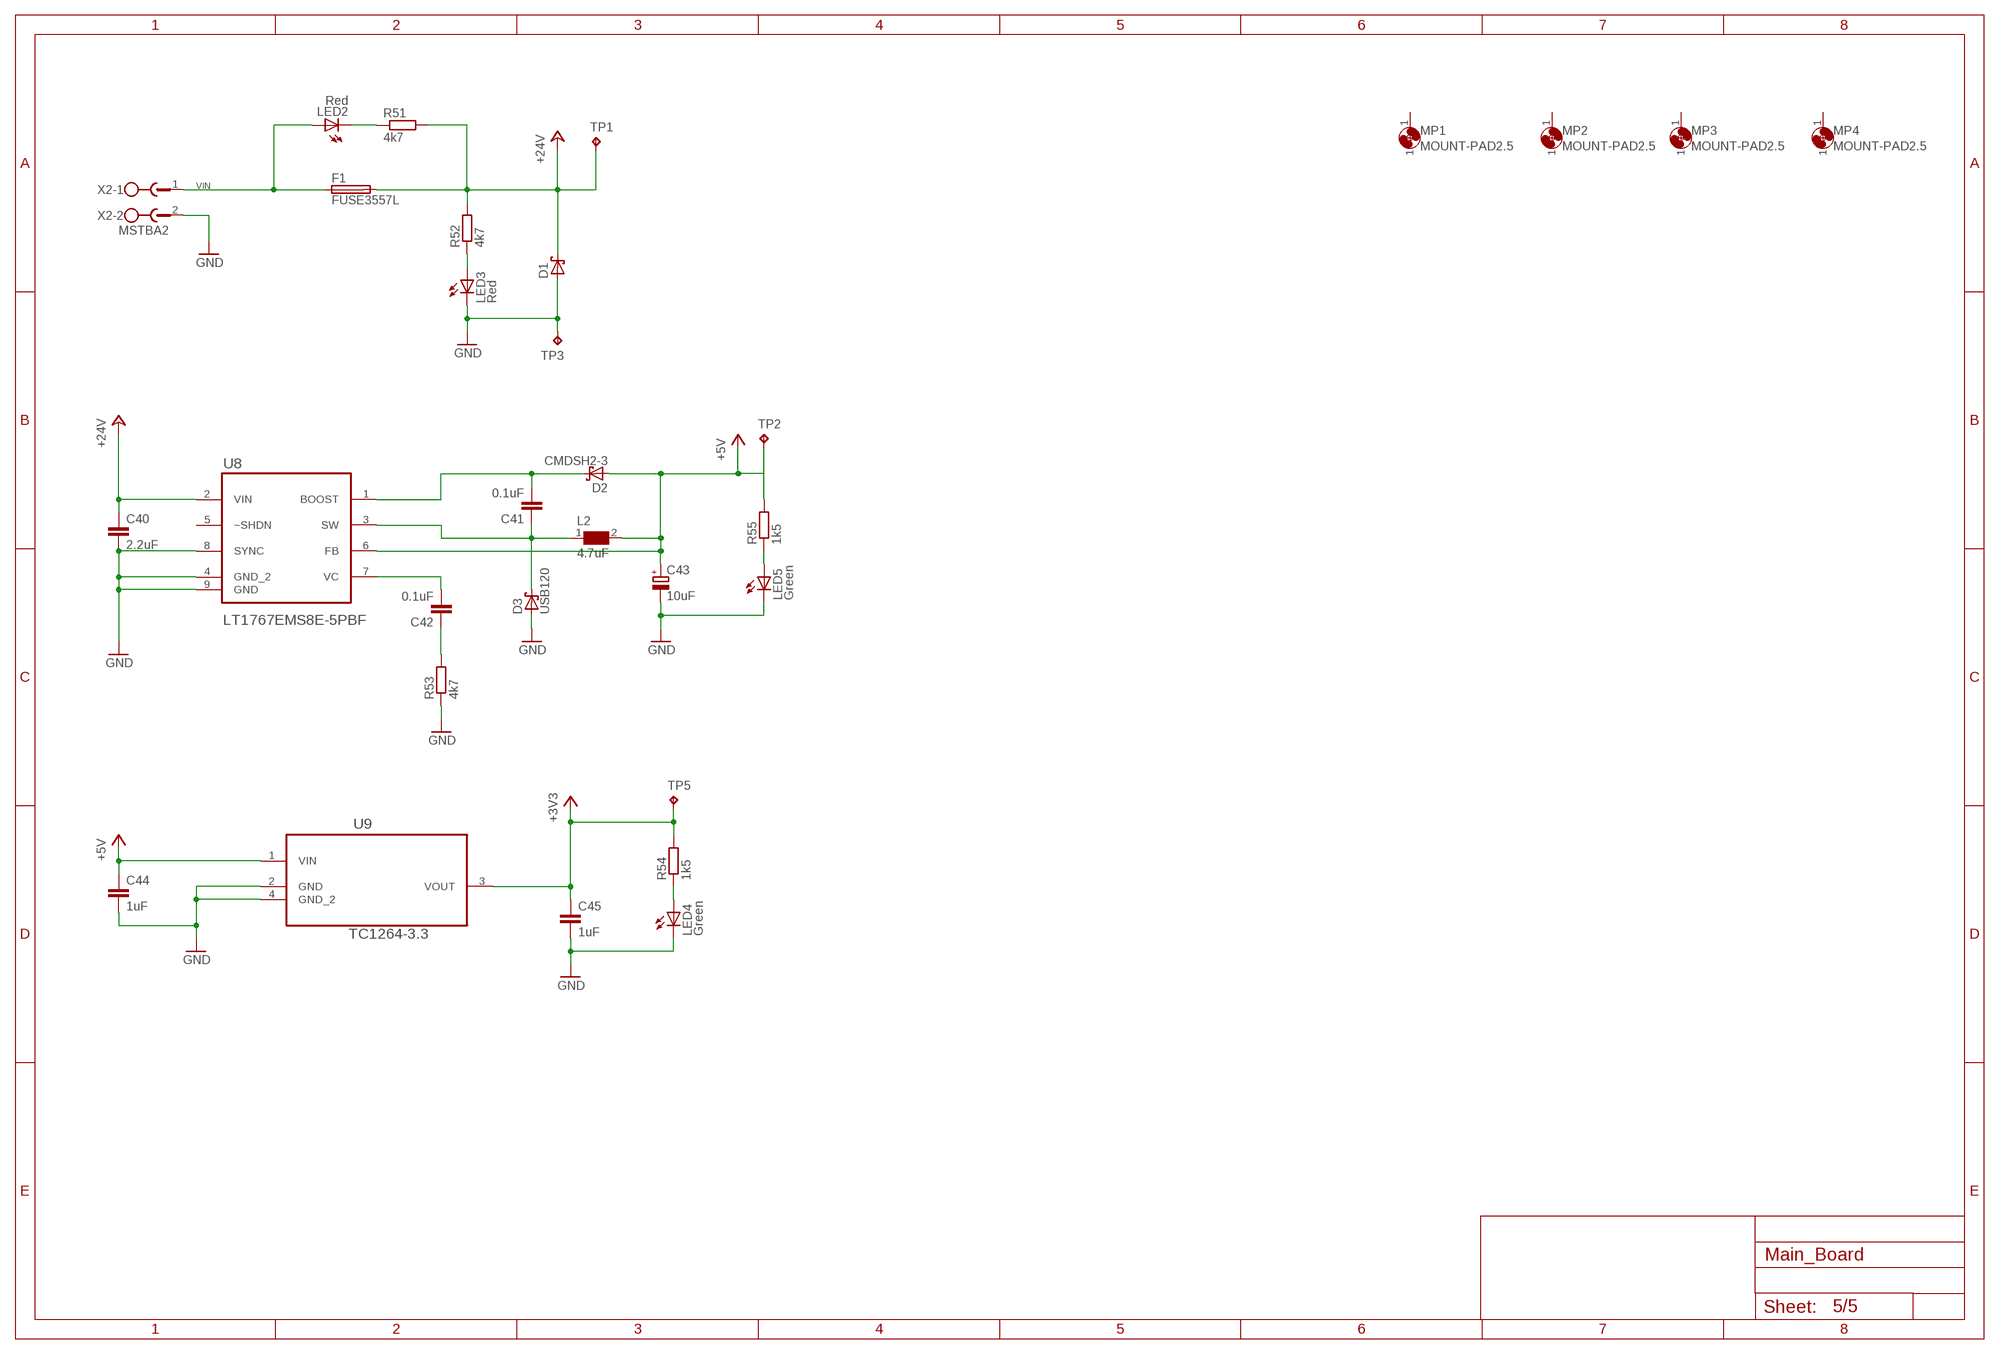
[diagram p4: schematic, sheet 5]

### Parts
C40  2.2uF  C-EUC0603  [C0603]
C41  0.1uF  C-EUC0603  [C0603]
C42  0.1uF  C-EUC0603  [C0603]
C43  10uF  CPOL-EUCT3216  [CT3216]
C44  1uF  C-EUC0603  [C0603]
C45  1uF  C-EUC0603  [C0603]
D1  STPS3L40UF  [SMB]
D2  CMDSH2-3  [SOD323-W]
D3  USB120  [DO216AA]
F1  FUSE3557L  [3557-LITTLE]
L2  4.7uF  WE-PD-7447713047_1030/1050  [WE-PD_1030/1050]
LED2  Red  LEDCHIPLED_0603  [CHIPLED_0603]
LED3  Red  LEDCHIPLED_0603  [CHIPLED_0603]
LED4  Green  LEDCHIP-LED0603  [CHIP-LED0603]
LED5  Green  LEDCHIP-LED0603  [CHIP-LED0603]
MP1  MOUNT-PAD2.5  [P2.5]
MP2  MOUNT-PAD2.5  [P2.5]
MP3  MOUNT-PAD2.5  [P2.5]
MP4  MOUNT-PAD2.5  [P2.5]
R51  4k7  R-EU_R0603  [R0603]
R52  4k7  R-EU_R0603  [R0603]
R53  4k7  R-EU_R0603  [R0603]
R54  1k5  R-EU_R0603  [R0603]
R55  1k5  R-EU_R0603  [R0603]
TP1  TPB1,27  [B1,27]
TP2  TPB1,27  [B1,27]
TP3  TPB1,27  [B1,27]
TP5  TPB1,27  [B1,27]
U8  LT1767EMS8E-5PBF  [SOP65P490X110-9N]
U9  TC1264-3.3  [SOT230P700X180-4N]
X2  MSTBA2  [MSTBA2]

### Nets
+3V3 [supply]: C45.1 R54.2 TP5.TP U9.3(VOUT) ; also sheet 1,2,3,4
+5V [supply]: C43.+ C44.1 D2.A L2.2 R55.2 TP2.TP U8.6(FB) U9.1(VIN) ; also sheet 1,3,4
+24V: C40.1 D1.C F1.3 F1.4 R51.2 R52.2 TP1.TP U8.2(VIN) ; also sheet 1,3
GND [supply]: C40.2 C43.- C44.2 C45.2 D1.A D3.A LED3.C LED4.C LED5.C R53.1 TP3.TP U8.4(GND_2) U8.8(SYNC) U8.9(GND) U9.2(GND) U9.4(GND_2) X2.2 ; also sheet 1,2,3,4
N$43: C41.2 D2.C U8.1(BOOST)
N$44: LED3.A R52.1
N$45: LED2.C R51.1
N$47: C42.1 R53.2
N$48: C42.2 U8.7(VC)
N$49: C41.1 D3.C L2.1 U8.3(SW)
N$50: LED4.A R54.1
N$51: LED5.A R55.1
VIN: F1.1 F1.2 LED2.A X2.1
Unconnected: MP1.1 MP2.1 MP3.1 MP4.1 U8.5(~SHDN)

## Library data of the parts
C1 C2 C4 C6 C8-C30 C32-C38 C40-C42 C46-C55 = rcl:C-EU: CAPACITOR, European symbol
C3 C5 C7 C39 C43 = rcl:CPOL-EU: POLARIZED CAPACITOR, European symbol
C44 C45 = rcl:C-EU: CAPACITOR, European symbol; OC_FARNELL: unknown
D1 = diode:STPS3L40?; MP: STMICROELECTRONICS; MPN: STPS3L40UF; OC_FARNELL: 2341599
D2 = diode:CMDSH2-3
D3 = diode:USB120
F1 = fuse2:FUSE: Fuse
J1 J2 J11-J14 = con-molex:22-?-02: CONNECTOR wire to board 2.54 mm (.1 inch) pitch header; OC_FARNELL: 9731601; OC_NEWARK: unknown
J3 J4 = con-molex:22-?-04: CONNECTOR wire to board 2.54 mm (.1 inch) pitch header; OC_FARNELL: unknown; OC_NEWARK: unknown
J5 = con-amp:1241050-5
J6 J8 = Molex_By_element14_Batch_1:90814-0208: CONN HEADER 8POS 1.27MM SMD TIN; MPN: 90814-0208; OC_FARNELL: 1757025; OC_NEWARK: 34R6216; PACKAGE: CONN-8POS; SUPPLIER: Molex
J7 = Molex_By_element14_Batch_1:90814-0206: CONN HEADER 06 POS 1.27MM SMD TIN; MPN: 90814-0206; OC_FARNELL: 1757024; OC_NEWARK: 34R6215; PACKAGE: CONN-6 POS; SUPPLIER: Molex
J9 J10 = con-molex:22-?-03: CONNECTOR wire to board 2.54 mm (.1 inch) pitch header; OC_FARNELL: unknown; OC_NEWARK: unknown
J15 = con-molex:22-?-05: CONNECTOR wire to board 2.54 mm (.1 inch) pitch header; OC_FARNELL: unknown; OC_NEWARK: unknown
J16 = con-molex:22-?-06: CONNECTOR wire to board 2.54 mm (.1 inch) pitch header; OC_FARNELL: unknown; OC_NEWARK: unknown
JP1 = exmachina:BC-2-?
K1-K4 = relay:G6K: Low Signal Relay oeiwcsnts1.omron.com/.. D20G6K0100.pdf; OC_FARNELL: 4484794; OC_NEWARK: unknown
L1 = coilcraft:0603PS
L2 = WE-PD:WE-PD: SMD-Shielded Power Inductors WE-PD - Magnetically shielded version which results in a low leakage field - High storage capacity - Low self-losses - Highest possible current loading for SMD-Inducors -- Switching regulators with low operating voltages (computer, laptop, mobile phones, pagers) -- Integrated DC/DC-converter -- Is recommended for the application with switching regulators from National Semiconductor, Linear Technology, Texas Instruments and Fairchild Semiconductor, ect. -- Graphic cards -- Plastic base: Because of the one piece construction these are more suitable for high vibration or shock applications; MPN: 7447713047; OC_FARNELL: 2082661; OC_NEWARK: 88T7091; PACKAGE: 1030; SUPPLIER: Wuerth Elektronik
LED1-LED3 = led:LED: LED OSRAM: - CHIPLED LG R971, LG N971, LY N971, LG Q971, LY Q971, LO R971, LY R971 LH N974, LH R974 LS Q976, LO Q976, LY Q976 LO Q996 - Hyper CHIPLED LW Q18S LB Q993, LB Q99A, LB R99A - SideLED LS A670, LO A670, LY A670, LG A670, LP A670 LB A673, LV A673, LT A673, LW A673 LH A674 LY A675 LS A676, LA A676, LO A676, LY A676, LW A676 LS A679, LY A679, LG A679 - Hyper Micro SIDELED® LS Y876, LA Y876, LO Y876, LY Y876 LT Y87S - SmartLED LW L88C, LW L88S LB L89C, LB L89S, LG L890 LS L89K, LO L89K, LY L89K LS L896, LA L896, LO L896, LY L896 - TOPLED LS T670, LO T670, LY T670, LG T670, LP T670 LSG T670, LSP T670, LSY T670, LOP T670, LYG T670 LG T671, LOG T671, LSG T671 LB T673, LV T673, LT T673, LW T673 LH T674 LS T676, LA T676, LO T676, LY T676, LB T676, LH T676, LSB T676, LW T676 LB T67C, LV T67C, LT T67C, LS T67K, LO T67K, LY T67K, LW E67C LS E67B, LA E67B, LO E67B, LY E67B, LB E67C, LV E67C, LT E67C LW T67C LS T679, LY T679, LG T679 LS T770, LO T770, LY T770, LG T770, LP T770 LB T773, LV T773, LT T773, LW T773 LH T774 LS E675, LA E675, LY E675, LS T675 LS T776, LA T776, LO T776, LY T776, LB T776 LHGB T686 LT T68C, LB T68C - Hyper Mini TOPLED® LB M676 - Mini TOPLED Santana® LG M470 LS M47K, LO M47K, LY M47K Source: http://www.osram.convergy.de LUXEON: - LUMILED® LXK2-PW12-R00, LXK2-PW12-S00, LXK2-PW14-U00, LXK2-PW14-V00 LXK2-PM12-R00, LXK2-PM12-S00, LXK2-PM14-U00 LXK2-PE12-Q00, LXK2-PE12-R00, LXK2-PE12-S00, LXK2-PE14-T00, LXK2-PE14-U00 LXK2-PB12-K00, LXK2-PB12-L00, LXK2-PB12-M00, LXK2-PB14-N00, LXK2-PB14-P00, LXK2-PB14-Q00 LXK2-PR12-L00, LXK2-PR12-M00, LXK2-PR14-Q00, LXK2-PR14-R00 LXK2-PD12-Q00, LXK2-PD12-R00, LXK2-PD12-S00 LXK2-PH12-R00, LXK2-PH12-S00 LXK2-PL12-P00, LXK2-PL12-Q00, LXK2-PL12-R00 Source: www.luxeon.com KINGBRIGHT: KA-3528ASYC Source: www.kingbright.com
LED4 LED5 = led:LED: LED OSRAM: - CHIPLED LG R971, LG N971, LY N971, LG Q971, LY Q971, LO R971, LY R971 LH N974, LH R974 LS Q976, LO Q976, LY Q976 LO Q996 - Hyper CHIPLED LW Q18S LB Q993, LB Q99A, LB R99A - SideLED LS A670, LO A670, LY A670, LG A670, LP A670 LB A673, LV A673, LT A673, LW A673 LH A674 LY A675 LS A676, LA A676, LO A676, LY A676, LW A676 LS A679, LY A679, LG A679 - Hyper Micro SIDELED® LS Y876, LA Y876, LO Y876, LY Y876 LT Y87S - SmartLED LW L88C, LW L88S LB L89C, LB L89S, LG L890 LS L89K, LO L89K, LY L89K LS L896, LA L896, LO L896, LY L896 - TOPLED LS T670, LO T670, LY T670, LG T670, LP T670 LSG T670, LSP T670, LSY T670, LOP T670, LYG T670 LG T671, LOG T671, LSG T671 LB T673, LV T673, LT T673, LW T673 LH T674 LS T676, LA T676, LO T676, LY T676, LB T676, LH T676, LSB T676, LW T676 LB T67C, LV T67C, LT T67C, LS T67K, LO T67K, LY T67K, LW E67C LS E67B, LA E67B, LO E67B, LY E67B, LB E67C, LV E67C, LT E67C LW T67C LS T679, LY T679, LG T679 LS T770, LO T770, LY T770, LG T770, LP T770 LB T773, LV T773, LT T773, LW T773 LH T774 LS E675, LA E675, LY E675, LS T675 LS T776, LA T776, LO T776, LY T776, LB T776 LHGB T686 LT T68C, LB T68C - Hyper Mini TOPLED® LB M676 - Mini TOPLED Santana® LG M470 LS M47K, LO M47K, LY M47K Source: http://www.osram.convergy.de LUXEON: - LUMILED® LXK2-PW12-R00, LXK2-PW12-S00, LXK2-PW14-U00, LXK2-PW14-V00 LXK2-PM12-R00, LXK2-PM12-S00, LXK2-PM14-U00 LXK2-PE12-Q00, LXK2-PE12-R00, LXK2-PE12-S00, LXK2-PE14-T00, LXK2-PE14-U00 LXK2-PB12-K00, LXK2-PB12-L00, LXK2-PB12-M00, LXK2-PB14-N00, LXK2-PB14-P00, LXK2-PB14-Q00 LXK2-PR12-L00, LXK2-PR12-M00, LXK2-PR14-Q00, LXK2-PR14-R00 LXK2-PD12-Q00, LXK2-PD12-R00, LXK2-PD12-S00 LXK2-PH12-R00, LXK2-PH12-S00 LXK2-PL12-P00, LXK2-PL12-Q00, LXK2-PL12-R00 Source: www.luxeon.com KINGBRIGHT: KA-3528ASYC Source: www.kingbright.com; MF: MULTICOMP; MPN: OVS-0604; OC_FARNELL: 1716771; OC_NEWARK: 15R2206
MP1-MP4 = holes:MOUNT-PAD: MOUNTING HOLE with drill center marker
P1 = con-wiznet:RB1-125BAG1A: Accessory RJ-45 With Transformer Connector - UDE
R1-R53 R56-R72 = rcl:R-EU_: RESISTOR, European symbol
R54 R55 = rcl:R-EU_: RESISTOR, European symbol; MF: MULTICOMP; MPN: MCMR06X1501FTL; OC_FARNELL: 2073391; OC_NEWARK: 58K4488
SJ1 SJ2 = SparkFun-Passives:SOLDERJUMPER: Solder Jumper Standard SMD solder jumper. Used to automate production. Two varients : Normally Open and Normally Closed are the same, but have different paste layers. NC will have a large amount of paste and should jumper during reflow.
SW1 SW2 = Switch_SMT:B3FS: Surface-mounting Switches Ideal for High-density Mounting
T1 = transistor:MMBT2222AL: General Purpose Transistors
TP1 TP3 = testpad:TP: Test pad
TP2 TP5 = testpad:TP: Test pad; OC_FARNELL: unknown; OC_NEWARK: unknown
U1 = NXP:LPC1768FBD100; COPYRIGHT: Copyright C 2015 Accelerated Designs. All rights reserved; MANUFACTURER_PART_NUMBER: lpc1768fbd100; VENDOR: NXP
U2 U3 U11 = ti:SN74LVC3G17DCTR: TRIPLE SCHMITT-TRIGGER BUFFER; MPN: SN74LVC3G17DCTR; OC_FARNELL: 1236391; OC_NEWARK: 90H3713; PACKAGE: SSOP-8; SUPPLIER: Texas Instruments
U4 = ti:TPL0401
U5 = atmel:AT24C512C-SSHM-B: SERIAL EEPROM IC Memory Size:512Kbit,8-SOIC; MPN: AT24C02C-SSHM-B; OC_FARNELL: 1971995; OC_NEWARK: 68T4066; PACKAGE: 8SOIC; SUPPLIER: ATMEL
U6 U7 = ti:SN74LVC2G17DBVR: DUAL SCHMITT-TRIGGER BUFFER; MPN: SN74LVC2G17DBVR; OC_FARNELL: 1470776; OC_NEWARK: 76C4207; PACKAGE: SOT-23-6; SUPPLIER: Texas Instruments
U8 = lineartechnology:LT1767EMS8E-5PBF: Step-Down Switching Regulators; MPN: LT1767EMS8E-5#PBF; OC_FARNELL: 1663491; OC_NEWARK: 57M6275; PACKAGE: MSOP-8; SUPPLIER: Linear Technology
U9 = microchip-6:TC1264-3.3: IC, 8 00mA Fixed Output CMOS LDO,3.3V,SOT-223, 3-lead; OC_FARNELL: unknown; PACKAGE: SOT-223-3; SUPPLIER: Microchip
U$1 = exmachina:EXMACHINA-LOGO
U$2 = texas:DP83848JSQ/NOPB; COPYRIGHT: Copyright (C) 2015 Accelerated Designs. All rights reserved; MANUFACTURER_PART_NUMBER: dp83848jsqnopb; VENDOR: National Semiconductor
U$3 U$10 = crystal:ASE: 3.3Vdc CMOS SMD CRYSTAL CLOCK OSCILLATOR SOurce: www.abracon.com; OC_FARNELL: unknown; OC_NEWARK: unknown
U$4 = Microchip_By_element14_Batch_1:MCP2561-E/SN: High-Speed CAN Transceiver; MPN: MCP2551-I/SN; PACKAGE: SOIC-8; SUPPLIER: Microchip
U$5 = con-multicomp:5504F1-09S-02A-03: D-Sub 9pts, Righ-angle, solder
U$6 = con-GlobalConnectorTechnology:USB3075-30-A
U$14 = keystone:3000
X1 = crystal:FC-135: 32.768kHz ±20ppm Crystal 12.5pF 70 kOhm -40°C ~ 85°C Surface Mount 2-SMD
X2 = con-phoenix-508:MSTBA2: PHOENIX; MF: FARNELL; MPN: 1757242; OC_FARNELL: 3705171; OC_NEWARK: 71C4161

## Net classes
1 signal: width 0.178 mm, drill 0.35 mm
2 supply: width 0.008 mm, drill 0.5 mm